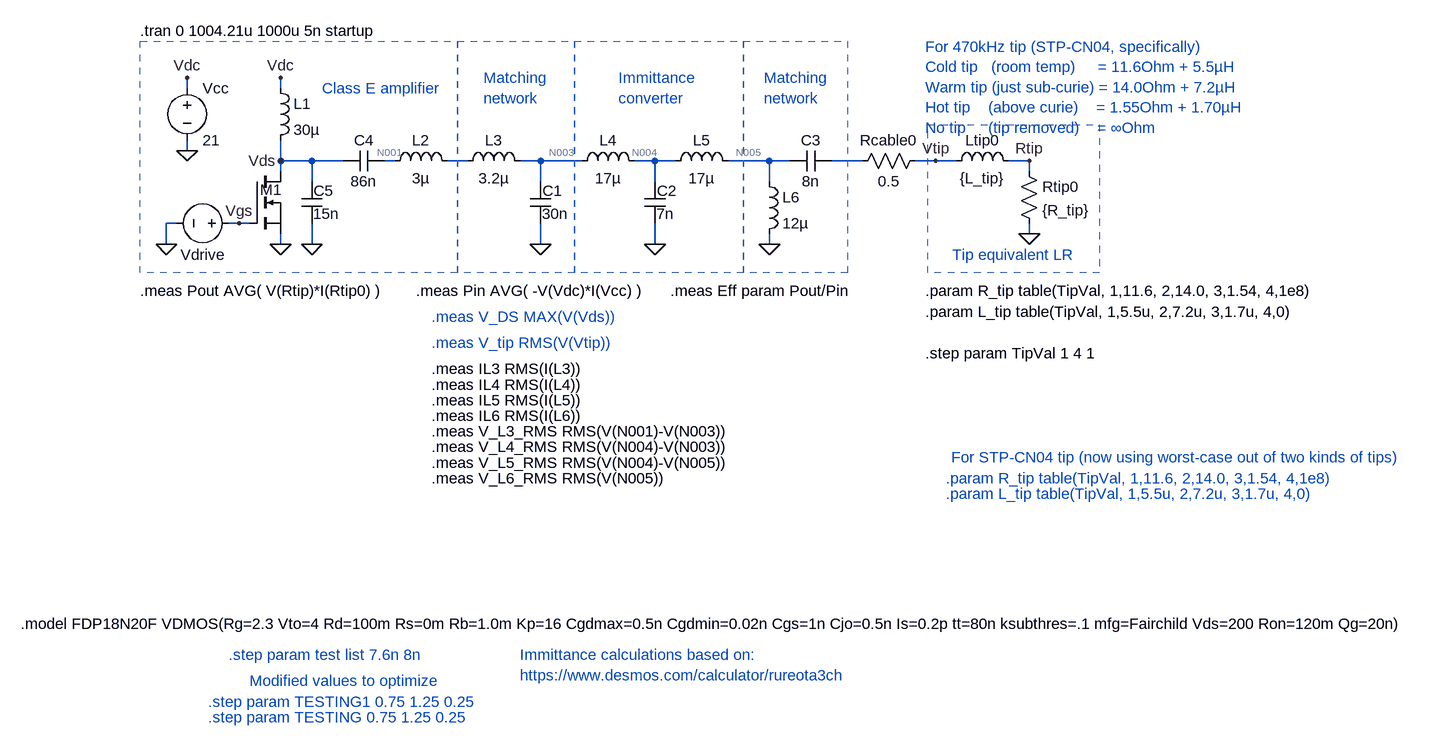
[diagram p0: schematic from_discord_sept5_2026.asc]
from_discord_sept5_2026.asc, the LTspice schematic file:
Version 4
SHEET 1 2624 1080
WIRE 96 96 96 80
WIRE 240 96 240 80
WIRE 96 192 96 176
WIRE 240 208 240 176
WIRE 288 208 240 208
WIRE 336 208 288 208
WIRE 416 208 400 208
WIRE 528 208 496 208
WIRE 640 208 608 208
WIRE 704 208 640 208
WIRE 816 208 784 208
WIRE 848 208 816 208
WIRE 992 208 928 208
WIRE 1024 208 992 208
WIRE 1136 208 1088 208
WIRE 1248 208 1216 208
WIRE 1280 208 1248 208
WIRE 1392 208 1360 208
WIRE 240 224 240 208
WIRE 1392 224 1392 208
WIRE 288 240 288 208
WIRE 640 240 640 208
WIRE 816 240 816 208
WIRE 992 240 992 208
WIRE 80 304 64 304
WIRE 176 304 160 304
WIRE 192 304 176 304
WIRE 1392 320 1392 304
WIRE 64 336 64 304
WIRE 240 336 240 320
WIRE 288 336 288 304
WIRE 640 336 640 304
WIRE 816 336 816 304
WIRE 992 336 992 320
FLAG 64 336 0
FLAG 240 336 0
FLAG 96 192 0
FLAG 1392 208 Rtip
FLAG 288 336 0
FLAG 640 336 0
FLAG 816 336 0
FLAG 992 336 0
FLAG 1392 320 0
FLAG 240 208 Vds
FLAG 176 304 Vgs
FLAG 96 80 Vdc
FLAG 240 80 Vdc
FLAG 1248 208 Vtip
SYMBOL voltage 96 80 R0
WINDOW 123 24 132 Left 0
SYMATTR InstName Vcc
SYMATTR Value 21
SYMBOL voltage 176 304 R90
WINDOW 123 24 132 Left 0
WINDOW 0 48 22 VRight 2
WINDOW 3 24 96 Invisible 2
SYMATTR InstName Vdrive
SYMATTR Value PULSE(0 16 0 50n 50n 1.065u 2.13u)
SYMATTR SpiceLine Rser=5
SYMBOL ind 224 80 R0
SYMATTR InstName L1
SYMATTR Value 30µ
SYMATTR SpiceLine Rser=0.1 Rpar=0.1G
SYMBOL ind 1264 224 R270
WINDOW 0 32 56 VTop 2
WINDOW 3 5 56 VBottom 2
SYMATTR InstName Ltip0
SYMATTR Value {L_tip}
SYMATTR SpiceLine Rser=0.1 Rpar=100Meg
SYMBOL Res 1376 208 R0
SYMATTR InstName Rtip0
SYMATTR Value {R_tip}
SYMBOL Cap 400 192 R90
WINDOW 0 0 32 VBottom 2
WINDOW 3 32 32 VTop 2
SYMATTR InstName C4
SYMATTR Value 86n
SYMATTR SpiceLine Rser=30m Rpar=1Meg
SYMBOL Cap 272 240 R0
WINDOW 0 19 14 Left 2
WINDOW 3 18 49 Left 2
SYMATTR InstName C5
SYMATTR Value 15n
SYMATTR SpiceLine Rser=30m Rpar=1Meg
SYMBOL ind 400 224 R270
WINDOW 0 32 56 VTop 2
WINDOW 3 5 56 VBottom 2
SYMATTR InstName L2
SYMATTR Value 3µ
SYMATTR SpiceLine Rser=0.03 Rpar=0.1G
SYMBOL ind 512 224 R270
WINDOW 0 32 56 VTop 2
WINDOW 3 5 56 VBottom 2
SYMATTR InstName L3
SYMATTR Value 3.2µ
SYMATTR SpiceLine Rser=0.03 Rpar=0.1G
SYMBOL Cap 624 240 R0
WINDOW 0 19 14 Left 2
WINDOW 3 18 49 Left 2
SYMATTR InstName C1
SYMATTR Value 30n
SYMATTR SpiceLine Rser=30m Rpar=100Meg
SYMBOL ind 688 224 R270
WINDOW 0 32 56 VTop 2
WINDOW 3 5 56 VBottom 2
SYMATTR InstName L4
SYMATTR Value 17µ
SYMATTR SpiceLine Rser=0.1 Rpar=0.1G
SYMBOL Cap 800 240 R0
WINDOW 0 19 14 Left 2
WINDOW 3 18 49 Left 2
SYMATTR InstName C2
SYMATTR Value 7n
SYMATTR SpiceLine Rser=50m Rpar=100Meg
SYMBOL ind 832 224 R270
WINDOW 0 32 56 VTop 2
WINDOW 3 5 56 VBottom 2
SYMATTR InstName L5
SYMATTR Value 17µ
SYMATTR SpiceLine Rser=0.1 Rpar=0.1G
SYMBOL ind 976 224 R0
SYMATTR InstName L6
SYMATTR Value 12µ
SYMATTR SpiceLine Rser=0.1 Rpar=0.1G
SYMBOL Cap 1024 192 M90
WINDOW 0 0 32 VBottom 2
WINDOW 3 32 32 VTop 2
SYMATTR InstName C3
SYMATTR Value 8n
SYMATTR SpiceLine Rser=50m Rpar=0.1G
SYMBOL nmos 192 224 R0
WINDOW 0 16 28 Left 2
WINDOW 3 60 93 Invisible 2
SYMATTR InstName M1
SYMATTR Value FDP18N20F
SYMBOL Res 1232 192 R90
WINDOW 0 0 56 VBottom 2
WINDOW 3 32 56 VTop 2
SYMATTR InstName Rcable0
SYMATTR Value 0.5
TEXT 24 8 Left 2 !.tran 0 1004.21u 1000u 5n startup
TEXT 1368 352 Center 2 ;Tip equivalent LR
TEXT 1232 32 Left 2 ;For 470kHz tip (STP-CN04, specifically)\nCold tip   (room temp)     = 11.6Ohm + 5.5µH\nWarm tip (just sub-curie) = 14.0Ohm + 7.2µH\nHot tip    (above curie)    = 1.55Ohm + 1.70µH\nNo tip     (tip removed)    = ∞Ohm
TEXT 304 96 Left 2 ;Class E amplifier
TEXT 1232 408 Left 2 !.param R_tip table(TipVal, 1,11.6, 2,14.0, 3,1.54, 4,1e8)
TEXT 1232 440 Left 2 !.param L_tip table(TipVal, 1,5.5u, 2,7.2u, 3,1.7u, 4,0)
TEXT 24 408 Left 2 !.meas Pout AVG( V(Rtip)*I(Rtip0) )
TEXT 448 408 Left 2 !.meas Pin AVG( -V(Vdc)*I(Vcc) )
TEXT -160 920 Left 2 !.model FDP18N20F VDMOS(Rg=2.3 Vto=4 Rd=100m Rs=0m Rb=1.0m Kp=16 Cgdmax=0.5n Cgdmin=0.02n Cgs=1n Cjo=0.5n Is=0.2p tt=80n ksubthres=.1 mfg=Fairchild Vds=200 Ron=120m Qg=20n)
TEXT 608 968 Left 2 ;Immittance calculations based on:\nhttps://www.desmos.com/calculator/rureota3ch
TEXT 840 408 Left 2 !.meas Eff param Pout/Pin
TEXT 128 1040 Left 2 ;.step param TESTING1 0.75 1.25 0.25
TEXT 192 1008 Left 2 ;Modified values to optimize
TEXT 128 1064 Left 2 ;.step param TESTING 0.75 1.25 0.25
TEXT 160 968 Left 2 ;.step param test list 7.6n 8n
TEXT 1264 696 Left 2 ;.param R_tip table(TipVal, 1,11.6, 2,14.0, 3,1.54, 4,1e8)
TEXT 1272 664 Left 2 ;For STP-CN04 tip (now using worst-case out of two kinds of tips)
TEXT 1264 720 Left 2 ;.param L_tip table(TipVal, 1,5.5u, 2,7.2u, 3,1.7u, 4,0)
TEXT 552 80 Left 2 ;Matching\nnetwork
TEXT 760 80 Left 2 ;Immittance\nconverter
TEXT 984 80 Left 2 ;Matching\nnetwork
TEXT 472 448 Left 2 ;.meas V_DS MAX(V(Vds))
TEXT 472 488 Left 2 ;.meas V_tip RMS(V(Vtip))
TEXT 472 528 Left 2 !.meas IL3 RMS(I(L3))
TEXT 472 552 Left 2 !.meas IL4 RMS(I(L4))
TEXT 472 576 Left 2 !.meas IL5 RMS(I(L5))
TEXT 472 600 Left 2 !.meas IL6 RMS(I(L6))
TEXT 472 624 Left 2 !.meas V_L3_RMS RMS(V(N001)-V(N003))
TEXT 472 648 Left 2 !.meas V_L4_RMS RMS(V(N004)-V(N003))
TEXT 472 672 Left 2 !.meas V_L5_RMS RMS(V(N004)-V(N005))
TEXT 472 696 Left 2 !.meas V_L6_RMS RMS(V(N005))
TEXT 1232 504 Left 2 !.step param TipVal 1 4 1
RECTANGLE Normal 1236 152 1500 380 2
RECTANGLE Normal 24 24 512 380 2
RECTANGLE Normal 512 24 692 380 2
RECTANGLE Normal 692 24 952 380 2
RECTANGLE Normal 952 24 1112 380 2

The netlist it stands for:
* from_discord_sept5_2026.asc
Vcc Vdc 0 21
Vdrive Vgs 0 PULSE(0 16 0 50n 50n 1.065u 2.13u) Rser=5
L1 Vdc Vds 30µ Rser=0.1 Rpar=0.1G
Ltip0 Vtip Rtip {L_tip} Rser=0.1 Rpar=100Meg
Rtip0 Rtip 0 {R_tip}
C4 N001 Vds 86n Rser=30m Rpar=1Meg
C5 Vds 0 15n Rser=30m Rpar=1Meg
L2 N001 N002 3µ Rser=0.03 Rpar=0.1G
L3 N002 N003 3.2µ Rser=0.03 Rpar=0.1G
C1 N003 0 30n Rser=30m Rpar=100Meg
L4 N003 N004 17µ Rser=0.1 Rpar=0.1G
C2 N004 0 7n Rser=50m Rpar=100Meg
L5 N004 N005 17µ Rser=0.1 Rpar=0.1G
L6 N005 0 12µ Rser=0.1 Rpar=0.1G
C3 N005 N006 8n Rser=50m Rpar=0.1G
M1 Vds Vgs 0 0 FDP18N20F
Rcable0 Vtip N006 0.5
.model NMOS NMOS
.model PMOS PMOS
.lib standard.mos
.tran 0 1004.21u 1000u 5n startup
* Tip equivalent LR
* For 470kHz tip (STP-CN04, specifically)
* Cold tip   (room temp)     = 11.6Ohm + 5.5µH
* Warm tip (just sub-curie) = 14.0Ohm + 7.2µH
* Hot tip    (above curie)    = 1.55Ohm + 1.70µH
* No tip     (tip removed)    = ∞Ohm
* Class E amplifier
.param R_tip table(TipVal, 1,11.6, 2,14.0, 3,1.54, 4,1e8)
.param L_tip table(TipVal, 1,5.5u, 2,7.2u, 3,1.7u, 4,0)
.meas Pout AVG( V(Rtip)*I(Rtip0) )
.meas Pin AVG( -V(Vdc)*I(Vcc) )
.model FDP18N20F VDMOS(Rg=2.3 Vto=4 Rd=100m Rs=0m Rb=1.0m Kp=16 Cgdmax=0.5n Cgdmin=0.02n Cgs=1n Cjo=0.5n Is=0.2p tt=80n ksubthres=.1 mfg=Fairchild Vds=200 Ron=120m Qg=20n)
* Immittance calculations based on:
* https://www.desmos.com/calculator/rureota3ch
.meas Eff param Pout/Pin
* .step param TESTING1 0.75 1.25 0.25
* Modified values to optimize
* .step param TESTING 0.75 1.25 0.25
* .step param test list 7.6n 8n
* .param R_tip table(TipVal, 1,11.6, 2,14.0, 3,1.54, 4,1e8)
* For STP-CN04 tip (now using worst-case out of two kinds of tips)
* .param L_tip table(TipVal, 1,5.5u, 2,7.2u, 3,1.7u, 4,0)
* Matching
* network
* Immittance
* converter
* Matching
* network
* .meas V_DS MAX(V(Vds))
* .meas V_tip RMS(V(Vtip))
.meas IL3 RMS(I(L3))
.meas IL4 RMS(I(L4))
.meas IL5 RMS(I(L5))
.meas IL6 RMS(I(L6))
.meas V_L3_RMS RMS(V(N001)-V(N003))
.meas V_L4_RMS RMS(V(N004)-V(N003))
.meas V_L5_RMS RMS(V(N004)-V(N005))
.meas V_L6_RMS RMS(V(N005))
.step param TipVal 1 4 1
.backanno
.end